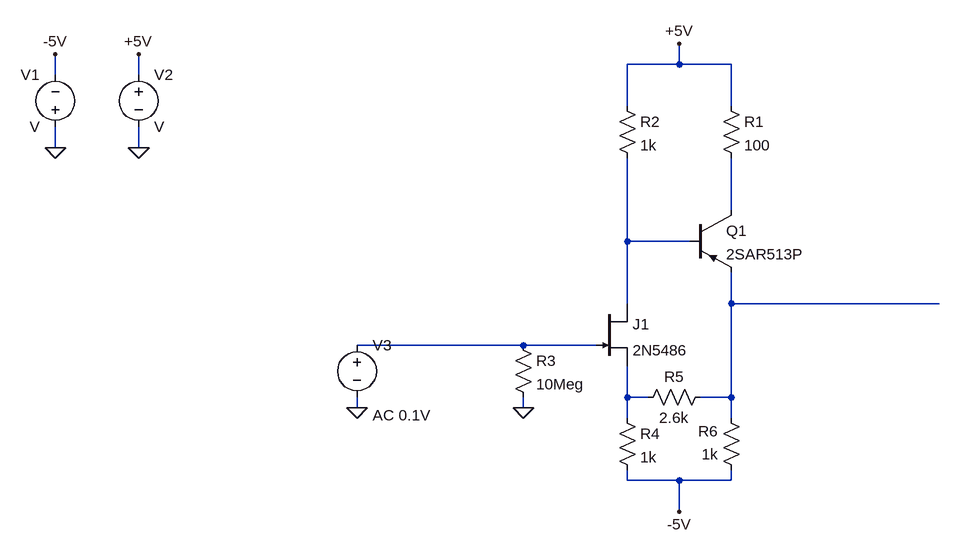
[diagram p0: schematic Draft3.asc]
Draft3.asc, the LTspice schematic file:
Version 4
SHEET 1 880 680
WIRE 256 -256 256 -288
WIRE 256 -256 176 -256
WIRE 336 -256 256 -256
WIRE -704 -240 -704 -272
WIRE -576 -240 -576 -272
WIRE 176 -192 176 -256
WIRE 336 -192 336 -256
WIRE -704 -128 -704 -160
WIRE -576 -128 -576 -160
WIRE 336 -32 336 -112
WIRE 176 16 176 -112
WIRE 272 16 176 16
WIRE 176 112 176 16
WIRE 336 112 336 64
WIRE 656 112 336 112
WIRE 16 176 -240 176
WIRE 128 176 16 176
WIRE 176 256 176 208
WIRE 208 256 176 256
WIRE 336 256 336 112
WIRE 336 256 288 256
WIRE -240 272 -240 256
WIRE 16 272 16 256
WIRE 176 288 176 256
WIRE 336 288 336 256
WIRE 176 384 176 368
WIRE 256 384 176 384
WIRE 336 384 336 368
WIRE 336 384 256 384
WIRE 256 432 256 384
FLAG -704 -128 0
FLAG -576 -128 0
FLAG -704 -272 -5V
FLAG -576 -272 +5V
FLAG 256 -288 +5V
FLAG -240 272 0
FLAG 16 272 0
FLAG 256 432 -5V
SYMBOL njf 128 112 R0
SYMATTR InstName J1
SYMATTR Value 2N5486
SYMBOL pnp 272 -32 R0
SYMATTR InstName Q1
SYMATTR Value 2SAR513P
SYMBOL res 320 -208 R0
SYMATTR InstName R1
SYMATTR Value 100
SYMBOL res 160 -208 R0
SYMATTR InstName R2
SYMATTR Value 1k
SYMBOL voltage -704 -144 R180
WINDOW 0 24 96 Left 2
WINDOW 3 24 16 Left 2
SYMATTR InstName V1
SYMBOL voltage -576 -256 R0
SYMATTR InstName V2
SYMBOL voltage -240 160 R0
WINDOW 123 24 124 Left 2
WINDOW 39 0 0 Left 0
SYMATTR InstName V3
SYMATTR Value ""
SYMATTR Value2 AC 0.1V
SYMBOL res 0 160 R0
SYMATTR InstName R3
SYMATTR Value 10Meg
SYMBOL res 160 272 R0
SYMATTR InstName R4
SYMATTR Value 1k
SYMBOL res 304 240 R90
WINDOW 0 0 56 VBottom 2
WINDOW 3 32 56 VTop 2
SYMATTR InstName R5
SYMATTR Value 2.6k
SYMBOL res 352 384 R180
WINDOW 0 36 76 Left 2
WINDOW 3 36 40 Left 2
SYMATTR InstName R6
SYMATTR Value 1k

The netlist it stands for:
* Draft3.asc
J1 N002 N004 N005 2N5486
Q1 N001 N002 N003 0 2SAR513P
R1 +5V N001 100
R2 +5V N002 1k
V1 0 -5V V
V2 +5V 0 V
V3 N004 0 AC 0.1V
R3 N004 0 10Meg
R4 N005 -5V 1k
R5 N003 N005 2.6k
R6 -5V N003 1k
.model NPN NPN
.model PNP PNP
.lib standard.bjt
.model NJF NJF
.model PJF PJF
.lib standard.jft
.backanno
.end